# Altium project MASTER.PrjPcb (part 3 of 3)

## Sheet CIV.SchDoc
size C
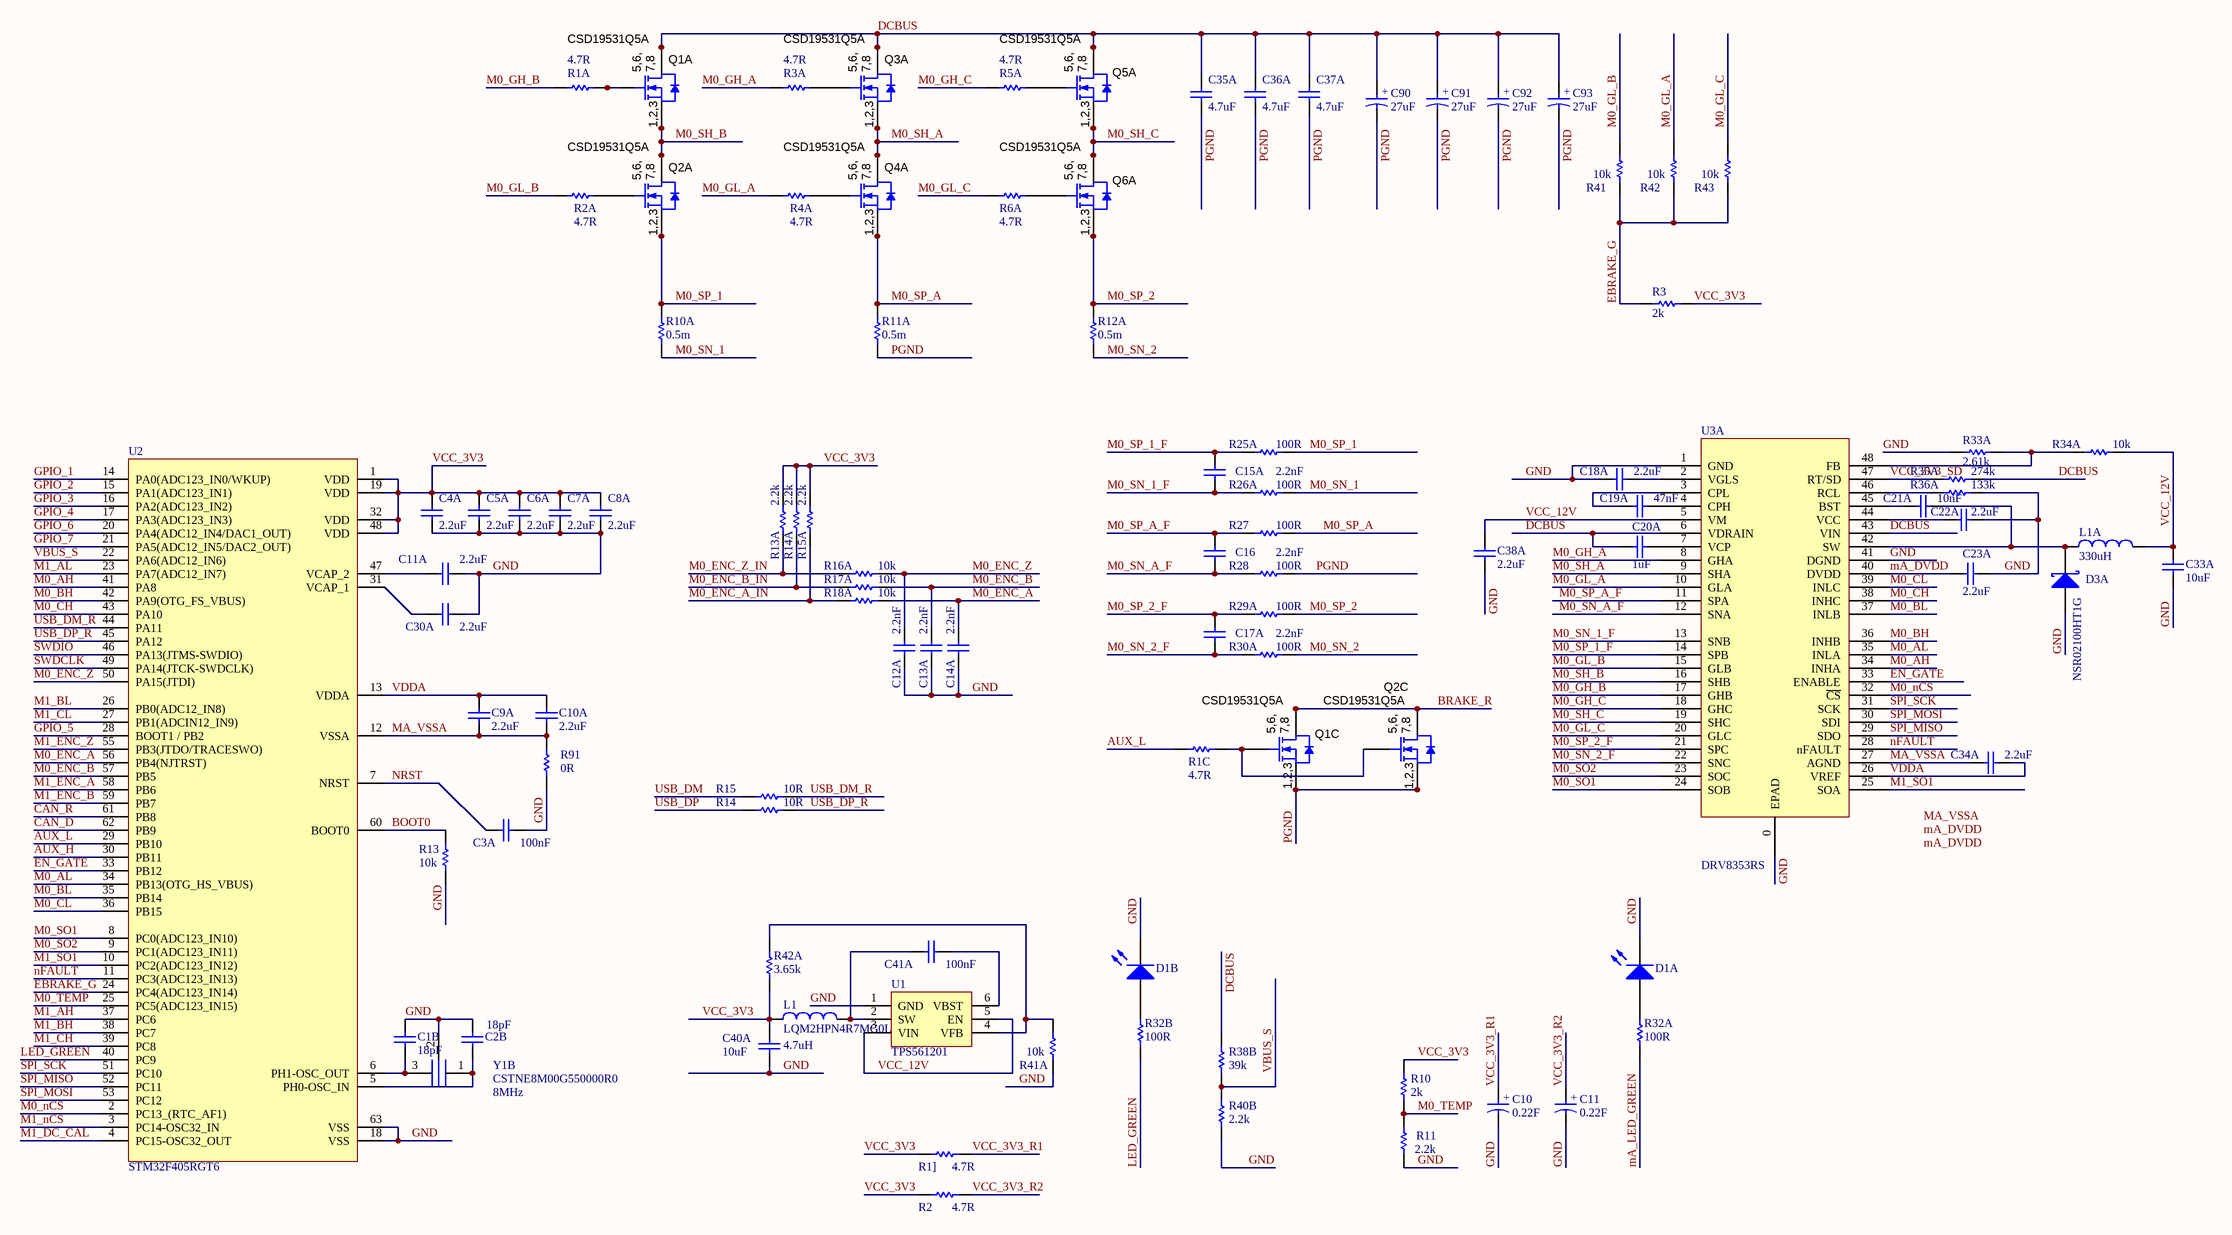
[diagram p6: CIV.SchDoc]

### Parts
(Parts that share a designator on the sheet are numbered #1, #2 ... from top to bottom, then left to right.)
C1B#4  value 18pF  [CAP 0402]  (hidden comment: GCM1555C1H180JA16D)
C2B#4  value 18pF  [CAP 0402]  (hidden comment: GCM1555C1H180JA16D)
C3A#4  value 100nF  [CAP 0402]  (hidden comment: C0402C104K3RACTU)
C4A#4  value 2.2uF  [CAP 0402]  (hidden comment: GRM155C81C225ME15D)
C5A#4  value 2.2uF  [CAP 0402]  (hidden comment: GRM155C81C225ME15D)
C6A#4  value 2.2uF  [CAP 0402]  (hidden comment: GRM155C81C225ME15D)
C7A#4  value 2.2uF  [CAP 0402]  (hidden comment: GRM155C81C225ME15D)
C8A#4  value 2.2uF  [CAP 0402]  (hidden comment: GRM155C81C225ME15D)
C9A#4  value 2.2uF  [CAP 0402]  (hidden comment: GRM155C81C225ME15D)
C10#2  value 0.22F  [DSK-621]  (hidden comment: DSK-3R3H224U-HL)
C10A#4  value 2.2uF  [CAP 0402]  (hidden comment: GRM155C81C225ME15D)
C11#2  value 0.22F  [DSK-621]  (hidden comment: DSK-3R3H224U-HL)
C11A#4  value 2.2uF  [CAP 0402]  (hidden comment: GRM155C81C225ME15D)
C12A#4  value 2.2nF  [CAP 0402]  (hidden comment: GCM155R72A222KA37D)
C13A#4  value 2.2nF  [CAP 0402]  (hidden comment: GCM155R72A222KA37D)
C14A#4  value 2.2nF  [CAP 0402]  (hidden comment: GCM155R72A222KA37D)
C15A#4  value 2.2nF  [CAP 0402]  (hidden comment: GCM155R72A222KA37D)
C16  value 2.2nF  [CAP 0402]  (hidden comment: GCM155R72A222KA37D)
C17A#4  value 2.2nF  [CAP 0402]  (hidden comment: GCM155R72A222KA37D)
C18A#3  value 2.2uF  [CAP 0402]  (hidden comment: GRM155C81C225ME15D)
C19A#3  value 47nF  [CAP 0603]  (hidden comment: C0603C473K1RECAUTO)
C20A#4  value 1uF  [CAP 0402]  (hidden comment: C0402C105K4PACTU)
C21A#3  value 10nF  [CAP 0402]  (hidden comment: GCM155R71E103JA37D)
C22A#3  value 2.2uF  [CAP 0402]  (hidden comment: GRM155C81C225ME15D)
C23A#3  value 2.2uF  [CAP 0402]  (hidden comment: GRM155C81C225ME15D)
C30A#4  value 2.2uF  [CAP 0402]  (hidden comment: GRM155C81C225ME15D)
C33A#4  value 10uF  [CAP 1206]  (hidden comment: TMK316AB7106KL-T)
C34A#5  value 2.2uF  [CAP 0402]  (hidden comment: GRM155C81C225ME15D)
C35A#4  value 4.7uF  [CAP 1210]  (hidden comment: CGA6M3X7S2A475M200AB)
C36A#4  value 4.7uF  [CAP 1210]  (hidden comment: CGA6M3X7S2A475M200AB)
C37A#4  value 4.7uF  [CAP 1210]  (hidden comment: CGA6M3X7S2A475M200AB)
C38A#3  value 2.2uF  [CAP 0402]  (hidden comment: GRM155C81C225ME15D)
C40A#3  value 10uF  [CAP 1206]  (hidden comment: TMK316AB7106KL-T)
C41A#3  value 100nF  [CAP 0402]  (hidden comment: C0402C104K3RACTU)
C90  value 27uF  [Panasonic F]  (hidden comment: 100SXV15M)
C91  value 27uF  [Panasonic F]  (hidden comment: 100SXV15M)
C92  value 27uF  [Panasonic F]  (hidden comment: 100SXV15M)
C93  value 27uF  [Panasonic F]  (hidden comment: 100SXV15M)
D1A#4  LTST-C190KRKT  [LED 0603]  (value not drawn)
D1B#4  LTST-C190KRKT  [LED 0603]  (value not drawn)
D3A#4  NSR02100HT1G  [SOD-323/SC76]
L1#3  LQM2HPN4R7MG0L  value 4.7uH  [IND 1008]
L1A#3  value 330uH  [SDE0805A]  (hidden comment: SDE0805A-331K)
Q1A#4  CSD19531Q5A  [VSONP-8]
Q1C#2  CSD19531Q5A  [VSONP-8]
Q2A#4  CSD19531Q5A  [VSONP-8]
Q2C#2  CSD19531Q5A  [VSONP-8]
Q3A#4  CSD19531Q5A  [VSONP-8]
Q4A#4  CSD19531Q5A  [VSONP-8]
Q5A#4  CSD19531Q5A  [VSONP-8]
Q6A#4  CSD19531Q5A  [VSONP-8]
R1]  value 4.7R  [RES 0402]  (hidden comment: ERJ-PA3J4R7V)
R1A#4  value 4.7R  [RES 0402]  (hidden comment: ERJ-PA3J4R7V)
R1C#2  value 4.7R  [RES 0402]  (hidden comment: ERJ-PA3J4R7V)
R2#2  value 4.7R  [RES 0402]  (hidden comment: ERJ-PA3J4R7V)
R2A#4  value 4.7R  [RES 0402]  (hidden comment: ERJ-PA3J4R7V)
R3#2  value 2k  [RES 0402]  (hidden comment: ERT-J0EG202GM)
R3A#4  value 4.7R  [RES 0402]  (hidden comment: ERJ-PA3J4R7V)
R4A#4  value 4.7R  [RES 0402]  (hidden comment: ERJ-PA3J4R7V)
R5A#4  value 4.7R  [RES 0402]  (hidden comment: ERJ-PA3J4R7V)
R6A#4  value 4.7R  [RES 0402]  (hidden comment: ERJ-PA3J4R7V)
R10#4  value 2k  [RES 0402]  (hidden comment: ERT-J0EG202GM)
R10A#4  0.5m  [RES 2512]
R11#4  value 2.2k  [RES 0402]  (hidden comment: ERJ-2RKF2201X)
R11A#2  0.5m  [RES 2512]
R12A#4  0.5m  [RES 2512]
R13#4  value 10k  [RES 0402]  (hidden comment: ERJ-2RKF1002X)
R13A#5  value 2.2k  [RES 0402]  (hidden comment: ERJ-2RKF2201X)
R14  value 10R  [RES 0402]  (hidden comment: ERJ-2RKF10R0X)
R14A#5  value 2.2k  [RES 0402]  (hidden comment: ERJ-2RKF2201X)
R15  value 10R  [RES 0402]  (hidden comment: ERJ-2RKF10R0X)
R15A#4  value 2.2k  [RES 0402]  (hidden comment: ERJ-2RKF2201X)
R16A#4  value 10k  [RES 0402]  (hidden comment: ERJ-2RKF1002X)
R17A#4  value 10k  [RES 0402]  (hidden comment: ERJ-2RKF1002X)
R18A#4  value 10k  [RES 0402]  (hidden comment: ERJ-2RKF1002X)
R25A#4  value 100R  [RES 0402]  (hidden comment: ERJ-2RKF1000X)
R26A#4  value 100R  [RES 0402]  (hidden comment: ERJ-2RKF1000X)
R27  value 100R  [RES 0402]  (hidden comment: ERJ-2RKF1000X)
R28  value 100R  [RES 0402]  (hidden comment: ERJ-2RKF1000X)
R29A#4  value 100R  [RES 0402]  (hidden comment: ERJ-2RKF1000X)
R30A#4  value 100R  [RES 0402]  (hidden comment: ERJ-2RKF1000X)
R32A#4  value 100R  [RES 0402]  (hidden comment: ERJ-2RKF1000X)
R32B#4  value 100R  [RES 0402]  (hidden comment: ERJ-2RKF1000X)
R33A#3  value 2.61k  [RES 0402]  (hidden comment: ERJ-2RKF2611X)
R34A#4  value 10k  [RES 0402]  (hidden comment: ERJ-2RKF1002X)
R35A#3  value 274k  [RES 0402]  (hidden comment: ERJ-2RKF2743X)
R36A#3  value 133k  [RES 0402]  (hidden comment: ERJ-2RKF1333X)
R38B#4  value 39k  [RES 0402]  (hidden comment: ERJ-2RKF3902X)
R40B#4  value 2.2k  [RES 0402]  (hidden comment: ERJ-2RKF2201X)
R41  value 10k  [RES 0402]  (hidden comment: ERJ-2RKF1002X)
R41A#3  value 10k  [RES 0402]  (hidden comment: ERJ-2RKF1002X)
R42  value 10k  [RES 0402]  (hidden comment: ERJ-2RKF1002X)
R42A#3  value 3.65k  [RES 0402]  (hidden comment: ERJ-2RKF3651X)
R43  value 10k  [RES 0402]  (hidden comment: ERJ-2RKF1002X)
R91#3  value 0R  [RES 0402]  (hidden comment: ERJ-2GE0R00X)
U1#3  TPS561201  [SOT-23-6]
U2#2  STM32F405RGT6  [QFP-64 - P0.5MM]
U3A#3  DRV8353RS  [QFN-48 - P0.5MM]
Y1B#4  CSTNE8M00G550000R0  value 8MHz  [MuRata CSTN]

### Nets
AUX_H: U2#2.30(PB11)
AUX_L: R1C#2.1 U2#2.29(PB10)
BOOT0: R13#4.2 U2#2.60(BOOT0)
BRAKE_R: Q1C#2.5(D) Q1C#2.6(D) Q1C#2.7(D) Q1C#2.8(D) Q1C#2.9(D) Q2C#2.5(D) Q2C#2.6(D) Q2C#2.7(D) Q2C#2.8(D) Q2C#2.9(D)
CAN_D: U2#2.62(PB9)
CAN_R: U2#2.61(PB8)
DCBUS: C20A#4.1 C35A#4.2 C36A#4.2 C37A#4.2 C90.2 C91.2 C92.2 C93.2 Q1A#4.5(D) Q1A#4.6(D) Q1A#4.7(D) Q1A#4.8(D) Q1A#4.9(D) Q3A#4.5(D) Q3A#4.6(D) Q3A#4.7(D) Q3A#4.8(D) Q3A#4.9(D) Q5A#4.5(D) Q5A#4.6(D) Q5A#4.7(D) Q5A#4.8(D) Q5A#4.9(D) R35A#3.2 R38B#4.2 U3A#3.6(VDRAIN) U3A#3.43(VIN)
EBRAKE_G: R3#2.2 R41.1 R42.1 R43.1 U2#2.24(PC4(ADC123_IN14))
EN_GATE: U2#2.33(PB12) U3A#3.33(ENABLE)
GND: C1B#4.2 C2B#4.2 C3A#4.2 C4A#4.2 C5A#4.2 C6A#4.2 C7A#4.2 C8A#4.2 C10#2.1 C11#2.1 C11A#4.2 C12A#4.1 C13A#4.1 C14A#4.1 C18A#3.2 C22A#3.1 C23A#3.1 C30A#4.2 C33A#4.2 C38A#3.2 C40A#3.2 D1A#4.2(K) D1B#4.2(K) D3A#4.1(A) R11#4.1 R13#4.1 R33A#3.1 R36A#3.2 R40B#4.1 R41A#3.1 R91#3.1 U1#3.1(GND) U2#2.18(VSS) U2#2.63(VSS) U3A#3.0(EPAD) U3A#3.1(GND) U3A#3.41(DGND) Y1B#4.2
GPIO_1: U2#2.14(PA0(ADC123_IN0/WKUP))
GPIO_2: U2#2.15(PA1(ADC123_IN1))
GPIO_3: U2#2.16(PA2(ADC123_IN2))
GPIO_4: U2#2.17(PA3(ADC123_IN3))
GPIO_5: U2#2.28(BOOT1_/_PB2)
GPIO_6: U2#2.20(PA4(ADC12_IN4/DAC1_OUT))
GPIO_7: U2#2.21(PA5(ADC12_IN5/DAC2_OUT))
LED_GREEN: R32B#4.2 U2#2.40(PC9)
M0_AH: U2#2.41(PA8) U3A#3.34(INHA)
M0_AL: U2#2.34(PB13(OTG_HS_VBUS)) U3A#3.35(INLA)
M0_BH: U2#2.42(PA9(OTG_FS_VBUS)) U3A#3.36(INHB)
M0_BL: U2#2.35(PB14) U3A#3.37(INLB)
M0_CH: U2#2.43(PA10) U3A#3.38(INHC)
M0_CL: U2#2.36(PB15) U3A#3.39(INLC)
M0_ENC_A: C14A#4.2 R18A#4.2 U2#2.56(PB4(NJTRST))
M0_ENC_A_IN: R15A#4.1 R18A#4.1
M0_ENC_B: C13A#4.2 R17A#4.2 U2#2.57(PB5)
M0_ENC_B_IN: R14A#5.1 R17A#4.1
M0_ENC_Z: C12A#4.2 R16A#4.2 U2#2.50(PA15(JTDI))
M0_ENC_Z_IN: R13A#5.1 R16A#4.1
M0_GH_A: R3A#4.1 U3A#3.8(GHA)
M0_GH_B: R1A#4.1 U3A#3.17(GHB)
M0_GH_C: R5A#4.1 U3A#3.18(GHC)
M0_GL_A: R4A#4.1 R42.2 U3A#3.10(GLA)
M0_GL_B: R2A#4.1 R41.2 U3A#3.15(GLB)
M0_GL_C: R6A#4.1 R43.2 U3A#3.20(GLC)
M0_nCS: U2#2.2(PC13_(RTC_AF1)) U3A#3.32(~{CS})
M0_SH_A: Q3A#4.1(S) Q3A#4.2(S) Q3A#4.3(S) Q4A#4.5(D) Q4A#4.6(D) Q4A#4.7(D) Q4A#4.8(D) Q4A#4.9(D) U3A#3.9(SHA)
M0_SH_B: Q1A#4.1(S) Q1A#4.2(S) Q1A#4.3(S) Q2A#4.5(D) Q2A#4.6(D) Q2A#4.7(D) Q2A#4.8(D) Q2A#4.9(D) U3A#3.16(SHB)
M0_SH_C: Q5A#4.1(S) Q5A#4.2(S) Q5A#4.3(S) Q6A#4.5(D) Q6A#4.6(D) Q6A#4.7(D) Q6A#4.8(D) Q6A#4.9(D) U3A#3.19(SHC)
M0_SN_1: R10A#4.1 R26A#4.2
M0_SN_1_F: C15A#4.1 R26A#4.1 U3A#3.13(SNB)
M0_SN_2: R12A#4.2 R30A#4.2
M0_SN_2_F: C17A#4.1 R30A#4.1 U3A#3.22(SNC)
M0_SN_A_F: C16.1 R28.1 U3A#3.12(SNA)
M0_SO1: U2#2.8(PC0(ADC123_IN10)) U3A#3.24(SOB)
M0_SO2: U2#2.9(PC1(ADC123_IN11)) U3A#3.23(SOC)
M0_SP_1: Q2A#4.1(S) Q2A#4.2(S) Q2A#4.3(S) R10A#4.2 R25A#4.2
M0_SP_1_F: C15A#4.2 R25A#4.1 U3A#3.14(SPB)
M0_SP_2: Q6A#4.1(S) Q6A#4.2(S) Q6A#4.3(S) R12A#4.1 R29A#4.2
M0_SP_2_F: C17A#4.2 R29A#4.1 U3A#3.21(SPC)
M0_SP_A: Q4A#4.1(S) Q4A#4.2(S) Q4A#4.3(S) R11A#2.2 R27.2
M0_SP_A_F: C16.2 R27.1 U3A#3.11(SPA)
M0_TEMP: R10#4.1 R11#4.2 U2#2.25(PC5(ADC123_IN15))
M1_AH: U2#2.37(PC6)
M1_AL: U2#2.23(PA7(ADC12_IN7))
M1_BH: U2#2.38(PC7)
M1_BL: U2#2.26(PB0(ADC12_IN8))
M1_CH: U2#2.39(PC8)
M1_CL: U2#2.27(PB1(ADCIN12_IN9))
M1_DC_CAL: U2#2.4(PC15-OSC32_OUT)
M1_ENC_A: U2#2.58(PB6)
M1_ENC_B: U2#2.59(PB7)
M1_ENC_Z: U2#2.55(PB3(JTDO/TRACESWO))
M1_nCS: U2#2.3(PC14-OSC32_IN)
M1_SO1: U2#2.10(PC2(ADC123_IN12)) U3A#3.25(SOA)
mA_DVDD: C23A#3.2 U3A#3.40(DVDD)
mA_LED_GREEN: R32A#4.2
MA_VSSA: C9A#4.2 C10A#4.2 C34A#5.2 R91#3.2 U2#2.12(VSSA) U3A#3.27(AGND)
nFAULT: U2#2.11(PC3(ADC123_IN13)) U3A#3.28(nFAULT)
NRST: C3A#4.1 U2#2.7(NRST)
PGND: C35A#4.1 C36A#4.1 C37A#4.1 C90.1 C91.1 C92.1 C93.1 Q1C#2.1(S) Q1C#2.2(S) Q1C#2.3(S) Q2C#2.1(S) Q2C#2.2(S) Q2C#2.3(S) R11A#2.1 R28.2  [project net mA_PA_SOURCE]
SPI_MISO: U2#2.52(PC11) U3A#3.29(SDO)
SPI_MOSI: U2#2.53(PC12) U3A#3.30(SDI)
SPI_SCK: U2#2.51(PC10) U3A#3.31(SCK)
SWDCLK: U2#2.49(PA14(JTCK-SWDCLK))
SWDIO: U2#2.46(PA13(JTMS-SWDIO))
USB_DM: R15.1
USB_DM_R: R15.2 U2#2.44(PA11)
USB_DP: R14.1
USB_DP_R: R14.2 U2#2.45(PA12)
VBUS_S: R38B#4.1 R40B#4.2 U2#2.22(PA6(ADC12_IN6))
VCC_3V3: C4A#4.1 C5A#4.1 C6A#4.1 C7A#4.1 C8A#4.1 C40A#3.1 L1#3.1 R1].1 R2#2.1 R3#2.1 R10#4.2 R13A#5.2 R14A#5.2 R15A#4.2 R42A#3.1 U2#2.1(VDD) U2#2.19(VDD) U2#2.32(VDD) U2#2.48(VDD)
VCC_3V3_R1: C10#2.2 R1].2
VCC_3V3_R2: C11#2.2 R2#2.2
VCC_3V3_SD: R35A#3.1 U3A#3.47(RT/SD)
VCC_12V: C33A#4.1 C38A#3.1 L1A#3.2 R34A#4.2 U1#3.3(VIN) U1#3.5(EN) U3A#3.5(VM)
VDDA: C9A#4.1 C10A#4.1 C34A#5.1 U2#2.13(VDDA) U3A#3.26(VREF)
NetC1B#4_1: C1B#4.1 U2#2.6(PH1-OSC_OUT) Y1B#4.3
NetC2B#4_1: C2B#4.1 U2#2.5(PH0-OSC_IN) Y1B#4.1
NetC11A#4_1: C11A#4.1 U2#2.47(VCAP_2)
NetC18A#3_1: C18A#3.1 U3A#3.2(VGLS)
NetC19A#3_1: C19A#3.1 U3A#3.3(CPL)
NetC19A#3_2: C19A#3.2 U3A#3.4(CPH)
NetC20A#4_2: C20A#4.2 U3A#3.7(VCP)
NetC21A#3_1: C21A#3.1 U3A#3.45(BST)
NetC21A#3_2: C21A#3.2 D3A#4.2(K) L1A#3.1 U3A#3.42(SW)
NetC22A#3_2: C22A#3.2 U3A#3.44(VCC)
NetC30A#4_1: C30A#4.1 U2#2.31(VCAP_1)
NetC41A#3_1: C41A#3.1 L1#3.2 U1#3.2(SW)
NetC41A#3_2: C41A#3.2 U1#3.6(VBST)
NetD1A#4_1: D1A#4.1(A) R32A#4.1
NetD1B#4_1: D1B#4.1(A) R32B#4.1
NetQ1A#4_4: Q1A#4.4(G) R1A#4.2
NetQ1C#2_4: Q1C#2.4(G) Q2C#2.4(G) R1C#2.2
NetQ2A#4_4: Q2A#4.4(G) R2A#4.2
NetQ3A#4_4: Q3A#4.4(G) R3A#4.2
NetQ4A#4_4: Q4A#4.4(G) R4A#4.2
NetQ5A#4_4: Q5A#4.4(G) R5A#4.2
NetQ6A#4_4: Q6A#4.4(G) R6A#4.2
NetR33A#3_2: R33A#3.2 R34A#4.1 U3A#3.48(FB)
NetR36A#3_1: R36A#3.1 U3A#3.46(RCL)
NetR41A#3_2: R41A#3.2 R42A#3.2 U1#3.4(VFB)

### Notes on the sheet
- Labels drawn without touching a wire or pin: mA_DVDD, MA_VSSA
- (in symbol 100SXV15M) +
- (in symbol CSD19531Q5A) 5,6,; 7,8; 1,2,3
- (in symbol DSK-3R3H224U-HL) +

### Library data of the parts
C1B#4 C2B#4 = GCM1555C1H180JA16D: CAP 0402 18pF 50V (NP0 Dielectric); WVDC: 50
C3A#4 C41A#3 = C0402C104K3RACTU: CAP 0402 100nF 10V; WVDC: 25
C4A#4 C5A#4 C6A#4 C7A#4 C8A#4 C9A#4 C10A#4 C11A#4 C18A#3 C22A#3 C23A#3 C30A#4 C34A#5 C38A#3 = GRM155C81C225ME15D: CAP 0402 2.2uF 16V; WVDC: 16
C10#2 C11#2 = DSK-3R3H224U-HL: Supercapacitors / Ultracapacitors 3.3V .22F 6.8x2.1; WVDC: 3.3
C12A#4 C13A#4 C14A#4 C15A#4 C16 C17A#4 = GCM155R72A222KA37D: CAP 0402 2.2nF 100V (X7R DIELECTRIC); WVDC: 100
C19A#3 = C0603C473K1RECAUTO: CAP 0603 47nF 100V (X7R DIELECTRIC); WVDC: 100
C20A#4 = C0402C105K4PACTU: CAP 0402 1uF 16V; WVDC: 16
C21A#3 = GCM155R71E103JA37D: CAP 0402 10nF 25V; WVDC: 25
C33A#4 C40A#3 = TMK316AB7106KL-T: CAP 1206 10uF 25V; WVDC: 25
C35A#4 C36A#4 C37A#4 = CGA6M3X7S2A475M200AB: CAP 1206 4.7uF 100V; WVDC: 100
C90-C93 = 100SXV15M: Aluminum Organic Polymer Capacitors 100volt 15uF 40mOhm 8x12mm OS-CON; WVDC: 100
D1A#4 D1B#4 = LTST-C190KRKT: RED LED
D3A#4 = NSR02100HT1G: Schottky Diodes & Rectifiers 100V; Vrrm: 100; If: 200mA
L1#3 = LQM2HPN4R7MG0L: Fixed Inductors 1008 4.7uH 20% 1.1A
L1A#3 = SDE0805A-331K: Fixed Inductors 330uH 10% SMD 0805 AEC-Q200; Isat: 400mA
Q1A#4 Q1C#2 Q2A#4 Q2C#2 Q3A#4 Q4A#4 Q5A#4 Q6A#4 = CSD19531Q5A: 100V 100A VSONP-8 5.3mOhm Pwr MOSFET; Manufacturer: Texas Instruments; Value2: 48 nC; QgTyp_nC: 48; SizeAreaWB_mm2: 56; SizeArea_mm2: 30; SizeX_mm: 6; SizeY_mm: 5; SizeZ_mm: 1; PartNumber: CSD19531Q5A; Value: 100V; VdsMax_V: 100V; Vgs_V: 100V; IdsMax_A: 100A; RoHS: Y; ComponentLink1Description: Datasheet link
R1] R1A#4 R1C#2 R2#2 R2A#4 R3A#4 R4A#4 R5A#4 R6A#4 = ERJ-PA3J4R7V: RES 0402 4.7R 5%
R3#2 R10#4 = ERT-J0EG202GM: NTC THERMISTOR 0402 2k 2%
R10A#4 R11A#2 R12A#4 = CSR2512C0R0005F: RES SMD 0.0005 OHM 1% 3W 2512; Manufacturer: Riedon; Temperature Coefficient: ±100ppm/°C; Supplier 1: Digi-Key; Supplier Part Number 1: 696-1183-2-ND; RoHS: RoHS Compliant; Category: Resistors; Stock: 2000; Pricing 1: 2000=0.19817, 6000=0.1937, 10000=0.187, 50000=0.18148 (USD); Packaging: Tape & Reel (TR); Part Status: Active; Tolerance: ±1%; Power (Watts): 3W; Composition: Metal Element; Features: Current Sense; Operating Temperature: -55°C ~ 170°C; Package / Case: 2512 (6432 Metric); Supplier Device Package: 2512; Size / Dimension: 0.250" L x 0.118" W (6.35mm x 3.00mm); Height - Seated (Max): 0.057" (1.45mm); Failure Rate: -; ComponentLink1URL: http://riedon.com/media/pdf/CSR.pdf; ComponentLink1Description: http://riedon.com/media/pdf/CSR.pdf; Supplier 2: Digi-Key; Supplier Part Number 2: 696-1183-1-ND; Pricing 2: 1=0.69, 10=0.574, 25=0.4916, 50=0.4426, 100=0.3852, 250=0.3442, 500=0.27864, 1000=0.22536 (USD); Manufacturer Part Number: CSR2512C0R0005F
R11#4 R13A#5 R14A#5 R15A#4 R40B#4 = ERJ-2RKF2201X: RES 0402 2.2k 1%
R13#4 R16A#4 R17A#4 R18A#4 R34A#4 R41 R41A#3 R42 R43 = ERJ-2RKF1002X: RES 0402 10k 1%
R14 R15 = ERJ-2RKF10R0X: RES 0402 10R 1%
R25A#4 R26A#4 R27 R28 R29A#4 R30A#4 R32A#4 R32B#4 = ERJ-2RKF1000X: RES 0402 100R 1%
R33A#3 = ERJ-2RKF2611X: RES 0402 2.61k 1%
R35A#3 = ERJ-2RKF2743X: RES 0402 274k 1%
R36A#3 = ERJ-2RKF1333X: RES 0402 133k 1%
R38B#4 = ERJ-2RKF3902X: RES 0402 39k 1%
R42A#3 = ERJ-2RKF3651X: RES 0402 3.65k 1%
R91#3 = ERJ-2GE0R00X: RES 0402 0R
U1#3 = TPS561201: 4.5V to 17V Input, 1A Synchronous Step-Down Voltage Regulator in 6-pin SOT-23
U2#2 = STM32F405RGT6(V2): Cortex M4 MCU
U3A#3 = DRV8353RS: 100V Three Phase Gate Driver With 3 Current Shunt Amplifiers and Buck Regulator (SPI)
Y1B#4 = CSTNE8M00G550000R0: Ceramic Resonator 8.0000MHz 33pf 0.5%

## Nets that join several sheets
AUX_H: OverDrive (U2#1.70), CIV (U2#2.30)
AUX_L: OverDrive (R1C#1.1 U2#1.69), CIV (R1C#2.1 U2#2.29)
BOOT0: Vesc (J10#1.2 R13#1.2 U1A#1.60 U1B#1.60), TestPanel (J10#2.2), Vesc_Simple_2 (J10#3.2 R13#2.2 U1A#2.60 U1B#2.60), OverDrive (R13#3.2), CIV (R13#4.2 U2#2.60)
CAN_D: OverDrive (U2#1.140), CIV (U2#2.62)
CAN_R: OverDrive (U2#1.139), CIV (U2#2.61)
DCBUS: OverDrive (44 pins), CIV (27 pins)
DISABLE_GATES: Vesc (J10#1.12 Q7A.1 Q7B.1 R12.2), TestPanel (J10#2.11), Vesc_Simple_2 (J10#3.11)
EN_GATE: OverDrive (U2#1.73 U3A#2.33 U3B#2.33), CIV (U2#2.33 U3A#3.33)
GND: Vesc (99 pins), TestPanel (12 pins), Vesc_Simple_2 (62 pins), OverDrive (58 pins), CIV (38 pins)
GPIO_1: OverDrive (U2#1.34), CIV (U2#2.14)
GPIO_2: OverDrive (U2#1.35), CIV (U2#2.15)
GPIO_3: OverDrive (U2#1.36), CIV (U2#2.16)
GPIO_4: OverDrive (U2#1.37), CIV (U2#2.17)
GPIO_5: OverDrive (U2#1.48), CIV (U2#2.28)
M0_AH: OverDrive (U2#1.100 U3A#2.34), CIV (U2#2.41 U3A#3.34)
M0_AL: OverDrive (U2#1.74 U3A#2.35), CIV (U2#2.34 U3A#3.35)
M0_BH: OverDrive (U2#1.101 U3A#2.36), CIV (U2#2.42 U3A#3.36)
M0_BL: OverDrive (U2#1.75 U3A#2.37), CIV (U2#2.35 U3A#3.37)
M0_CH: OverDrive (U2#1.102 U3A#2.38), CIV (U2#2.43 U3A#3.38)
M0_CL: OverDrive (U2#1.76 U3A#2.39), CIV (U2#2.36 U3A#3.39)
M0_ENC_A: OverDrive (C14A#3.2 R18A#3.2 U2#1.134), CIV (C14A#4.2 R18A#4.2 U2#2.56)
M0_ENC_A_IN: OverDrive (JHA#3.4 R15A#3.1 R18A#3.1), CIV (R15A#4.1 R18A#4.1)
M0_ENC_B: OverDrive (C13A#3.2 R17A#3.2 U2#1.135), CIV (C13A#4.2 R17A#4.2 U2#2.57)
M0_ENC_B_IN: OverDrive (JHA#3.3 R14A#4.1 R17A#3.1), CIV (R14A#5.1 R17A#4.1)
M0_ENC_Z: OverDrive (C12A#3.2 R16A#3.2 U2#1.110), CIV (C12A#4.2 R16A#4.2 U2#2.50)
M0_ENC_Z_IN: OverDrive (JHA#3.2 R13A#4.1 R16A#3.1), CIV (R13A#5.1 R16A#4.1)
M0_GH_A: OverDrive (R3A#3.1 U3A#2.8), CIV (R3A#4.1 U3A#3.8)
M0_GH_B: OverDrive (R1A#3.1 U3A#2.17), CIV (R1A#4.1 U3A#3.17)
M0_GH_C: OverDrive (R5A#3.1 U3A#2.18), CIV (R5A#4.1 U3A#3.18)
M0_GL_A: OverDrive (R4A#3.1 U3A#2.10), CIV (R4A#4.1 R42.2 U3A#3.10)
M0_GL_B: OverDrive (R2A#3.1 U3A#2.15), CIV (R2A#4.1 R41.2 U3A#3.15)
M0_GL_C: OverDrive (R6A#3.1 U3A#2.20), CIV (R6A#4.1 R43.2 U3A#3.20)
M0_nCS: OverDrive (U2#1.7 U3A#2.32), CIV (U2#2.2 U3A#3.32)
M0_SH_A: OverDrive (9 pins), CIV (9 pins)
M0_SH_B: OverDrive (9 pins), CIV (9 pins)
M0_SH_C: OverDrive (9 pins), CIV (9 pins)
M0_SN_1: OverDrive (R10A#3.1 R26A#3.2), CIV (R10A#4.1 R26A#4.2)
M0_SN_1_F: OverDrive (C15A#3.1 R26A#3.1 U3A#2.13), CIV (C15A#4.1 R26A#4.1 U3A#3.13)
M0_SN_2: OverDrive (R12A#3.2 R30A#3.2), CIV (R12A#4.2 R30A#4.2)
M0_SN_2_F: OverDrive (C17A#3.1 R30A#3.1 U3A#2.22), CIV (C17A#4.1 R30A#4.1 U3A#3.22)
M0_SO1: OverDrive (U2#1.26 U3A#2.24), CIV (U2#2.8 U3A#3.24)
M0_SO2: OverDrive (U2#1.27 U3A#2.23), CIV (U2#2.9 U3A#3.23)
M0_SP_1: OverDrive (5 pins), CIV (5 pins)
M0_SP_1_F: OverDrive (C15A#3.2 R25A#3.1 U3A#2.14), CIV (C15A#4.2 R25A#4.1 U3A#3.14)
M0_SP_2: OverDrive (5 pins), CIV (5 pins)
M0_SP_2_F: OverDrive (C17A#3.2 R29A#3.1 U3A#2.21), CIV (C17A#4.2 R29A#4.1 U3A#3.21)
M0_TEMP: OverDrive (R10#3.1 R11#3.2), CIV (R10#4.1 R11#4.2 U2#2.25)
M1_AH: OverDrive (U2#1.96 U3B#2.34), CIV (U2#2.37)
M1_AL: OverDrive (U2#1.43 U3B#2.35), CIV (U2#2.23)
M1_BH: OverDrive (U2#1.97 U3B#2.36), CIV (U2#2.38)
M1_BL: OverDrive (U2#1.46 U3B#2.37), CIV (U2#2.26)
M1_CH: OverDrive (U2#1.98 U3B#2.38), CIV (U2#2.39)
M1_CL: OverDrive (U2#1.47 U3B#2.39), CIV (U2#2.27)
M1_DC_CAL: OverDrive (U2#1.9), CIV (U2#2.4)
M1_ENC_A: OverDrive (C14B#3.2 R18B#3.2 U2#1.136), CIV (U2#2.58)
M1_ENC_B: OverDrive (C13B#3.2 R17B#3.2 U2#1.137), CIV (U2#2.59)
M1_ENC_Z: OverDrive (C12B#3.2 R16B#3.2 U2#1.133), CIV (U2#2.55)
M1_nCS: OverDrive (U2#1.8 U3B#2.32), CIV (U2#2.3)
M1_SO1: OverDrive (U2#1.28 U3B#2.24), CIV (U2#2.10 U3A#3.25)
mA_AGND: Vesc_Simple_2 (C34A#2.2), OverDrive (C34A#4.2)
mA_AN_IN: Vesc (R38A#1.1 R40A#1.2 U1A#1.11), Vesc_Simple_2 (R38A#2.1 R40A#2.2 U1A#2.10), OverDrive (R38A#3.1 R40A#3.2)
mA_CURRENT_A: Vesc (U1A#1.8 U3A#1.25), Vesc_Simple_2 (U1A#2.26 U12.1)
mA_CURRENT_C: Vesc (U1A#1.10 U3A#1.23), Vesc_Simple_2 (U1A#2.27 U11.1)
mA_DVDD: Vesc (5 pins), OverDrive (C23A#2.2 U3A#2.40), CIV (C23A#3.2 U3A#3.40)
mA_EN_GATE: Vesc (R39A.2 U1A#1.57), Vesc_Simple_2 (U1A#2.51)
mA_eStop: Vesc (J11#1.13 R7A.1 R8A.1 R9A.1), TestPanel (J12#2.13), Vesc_Simple_2 (J12#3.13)
mA_H1: Vesc (U1A#1.41 U3A#1.34), Vesc_Simple_2 (U1A#2.41 U22.6)
mA_H2: Vesc (U1A#1.42 U3A#1.36), Vesc_Simple_2 (U1A#2.42 U23.6)
mA_H3: Vesc (U1A#1.43 U3A#1.38), Vesc_Simple_2 (U1A#2.43 U24.6)
mA_HALL1_IN: Vesc (JHA#1.2 R15A#1.1 R18A#1.1), Vesc_Simple_2 (JHA#2.2 R15A#2.1 R18A#2.1)
mA_HALL2_IN: Vesc (JHA#1.3 R14A#1.1 R17A#1.1), Vesc_Simple_2 (JHA#2.3 R14A#3.1 R17A#2.1)
mA_HALL3_IN: Vesc (JHA#1.4 R13A#1.1 R16A#1.1), Vesc_Simple_2 (JHA#2.4 R13A#3.1 R16A#2.1)
mA_HALL_1: Vesc (C14A#1.2 R18A#1.2 U1A#1.37), Vesc_Simple_2 (C14A#2.2 R18A#2.2 U1A#2.58)
mA_HALL_2: Vesc (C13A#1.2 R17A#1.2 U1A#1.38), Vesc_Simple_2 (C13A#2.2 R17A#2.2 U1A#2.59)
mA_HALL_3: Vesc (C12A#1.2 R16A#1.2 U1A#1.39), Vesc_Simple_2 (C12A#2.2 R16A#2.2 U1A#2.52)
mA_L1: Vesc (U1A#1.34 U3A#1.35), Vesc_Simple_2 (U1A#2.34 U22.7)
mA_L2: Vesc (U1A#1.35 U3A#1.37), Vesc_Simple_2 (U1A#2.35 U23.7)
mA_L3: Vesc (U1A#1.36 U3A#1.39), Vesc_Simple_2 (U1A#2.36 U24.7)
mA_LED_GREEN: Vesc (R32A#1.2 U1A#1.26), Vesc_Simple_2 (R32A#2.2 U1A#2.17), OverDrive (R32A#3.2), CIV (R32A#4.2)
mA_MISO_ADC_EXT2: Vesc (J11#1.10 U1A#1.22), TestPanel (J11#2.5 JA.7), Vesc_Simple_2 (J11#3.5 U1A#2.22)
mA_nFAULT: Vesc (U1A#1.53 U3A#1.28), Vesc_Simple_2 (U1A#2.53)
mA_PA_AGND: Vesc (C35A#1.1 R10A#1.1 R26A#1.2), Vesc_Simple_2 (R10A#2.1 R26A#2.2)
mA_PA_AGND_F: Vesc (C15A#1.1 R26A#1.1 U3A#1.12), Vesc_Simple_2 (C15A#2.1 R26A#2.1 U12.3)
mA_PA_HI: Vesc (R1A#1.1 U3A#1.8), Vesc_Simple_2 (R1A#2.1 U22.4)
mA_PA_LO: Vesc (R2A#1.1 U3A#1.10), Vesc_Simple_2 (R2A#2.1 U22.9)
mA_PA_SOURCE: Vesc (10 pins), Vesc_Simple_2 (28 pins), OverDrive (20 pins), CIV (15 pins)
mA_PA_SOURCE_F: Vesc (C15A#1.2 R25A#1.1 U3A#1.11), Vesc_Simple_2 (C15A#2.2 R25A#2.1 U12.4)
mA_PB_HI: Vesc (R3A#1.1 U3A#1.17), Vesc_Simple_2 (R3A#2.1 U23.4)
mA_PB_LO: Vesc (R4A#1.1 U3A#1.15), Vesc_Simple_2 (R4A#2.1 U23.9)
mA_PC4: TestPanel (J11#2.12), Vesc_Simple_2 (J11#3.12 U1A#2.24)
mA_PC5: TestPanel (J11#2.13), Vesc_Simple_2 (J11#3.13 U1A#2.25)
mA_PC_AGND: Vesc (C37A#1.1 R12A#1.1 R30A#1.2), Vesc_Simple_2 (R12A#2.2 R30A#2.2)
mA_PC_AGND_F: Vesc (C17A#1.1 R30A#1.1 U3A#1.22), Vesc_Simple_2 (C17A#2.1 R30A#2.1 U11.3)
mA_PC_HI: Vesc (R5A#1.1 U3A#1.18), Vesc_Simple_2 (R5A#2.1 U24.4)
mA_PC_LO: Vesc (R6A#1.1 U3A#1.20), Vesc_Simple_2 (R6A#2.1 U24.9)
mA_PC_SOURCE: Vesc (5 pins), Vesc_Simple_2 (8 pins)
mA_PC_SOURCE_F: Vesc (C17A#1.2 R29A#1.1 U3A#1.21), Vesc_Simple_2 (C17A#2.2 R29A#2.1 U11.4)
mA_PHASE_A: Vesc (11 pins), Vesc_Simple_2 (12 pins)
mA_PHASE_B: Vesc (11 pins), Vesc_Simple_2 (12 pins)
mA_PHASE_C: Vesc (11 pins), Vesc_Simple_2 (12 pins)
mA_RX: Vesc (J11#1.8 U1A#1.30), TestPanel (J11#2.10 JA.6), Vesc_Simple_2 (J11#3.10 U1A#2.30)
mA_SCK_ADC_EXT: Vesc (J11#1.9 U1A#1.21), TestPanel (J11#2.4 JA.4), Vesc_Simple_2 (J11#3.4 U1A#2.21)
mA_SCL: TestPanel (J11#2.6), Vesc_Simple_2 (J11#3.6 U1A#2.23)
mA_SDA: TestPanel (J11#2.3), Vesc_Simple_2 (J11#3.3 U1A#2.20)
mA_SWDCLK: Vesc (J11#1.4 U1A#1.49), TestPanel (J11#2.2), Vesc_Simple_2 (J11#3.2 U1A#2.49)
mA_SWDIO: Vesc (J11#1.3 U1A#1.46), TestPanel (J11#2.1), Vesc_Simple_2 (J11#3.1 U1A#2.46)
mA_TX: Vesc (J11#1.7 U1A#1.29), TestPanel (J11#2.9 JA.5), Vesc_Simple_2 (J11#3.9 U1A#2.29)
mA_USB_DM: Vesc (J11#1.6 U1A#1.44), TestPanel (J11#2.8 R13A#2.1), Vesc_Simple_2 (J11#3.8 U1A#2.44)
mA_USB_DP: Vesc (J11#1.5 U1A#1.45), TestPanel (J11#2.7 R14A#2.1), Vesc_Simple_2 (J11#3.7 U1A#2.45)
mA_VOLTAGE_A: Vesc (R23A#1.1 R24A#1.2 U1A#1.14), Vesc_Simple_2 (R19A#2.1 R20A#2.2 U1A#2.16)
mA_VOLTAGE_B: Vesc (R21A#1.1 R22A#1.2 U1A#1.15), Vesc_Simple_2 (R21A#2.1 R22A#2.2 U1A#2.15)
mA_VOLTAGE_C: Vesc (R19A#1.1 R20A#1.2 U1A#1.16), Vesc_Simple_2 (R23A#2.1 R24A#2.2 U1A#2.14)
MA_VSSA: Vesc_Simple_2 (10 pins), OverDrive (C9A#3.2 R91#2.2), CIV (6 pins)
mB_AN_IN: Vesc (R38B#1.1 R40B#1.2 U1B#1.11), Vesc_Simple_2 (R38B#2.1 R40B#2.2 U1B#2.10), OverDrive (R38B#3.1 R40B#3.2)
mB_CURRENT_A: Vesc (U1B#1.8 U3B#1.25), Vesc_Simple_2 (U1B#2.26)
mB_CURRENT_C: Vesc (U1B#1.10 U3B#1.23), Vesc_Simple_2 (U1B#2.27)
mB_DVDD: Vesc (5 pins), OverDrive (C23B#3.2 U3B#2.40)
mB_EN_GATE: Vesc (R39B.2 U1B#1.57), Vesc_Simple_2 (U1B#2.51)
mB_eStop: Vesc (J11#1.12 R7B#1.1 R8B#1.1 R9B#1.1), TestPanel (J12#2.14), Vesc_Simple_2 (J12#3.14 R7B#2.1 R8B#2.1 R9B#2.1), OverDrive (R7B#3.1 R8B#3.1 R9B#3.1)
mB_H1: Vesc (U1B#1.41 U3B#1.34), Vesc_Simple_2 (U1B#2.41)
mB_H2: Vesc (U1B#1.42 U3B#1.36), Vesc_Simple_2 (U1B#2.42)
mB_H3: Vesc (U1B#1.43 U3B#1.38), Vesc_Simple_2 (U1B#2.43)
mB_HALL1_IN: Vesc (JHB#1.2 R15B#1.1 R18B#1.1), Vesc_Simple_2 (JHB#2.2 R15B#2.1 R18B#2.1)
mB_HALL2_IN: Vesc (JHB#1.3 R14B#1.1 R17B#1.1), Vesc_Simple_2 (JHB#2.3 R14B#3.1 R17B#2.1)
mB_HALL3_IN: Vesc (JHB#1.4 R13B#1.1 R16B#1.1), Vesc_Simple_2 (JHB#2.4 R13B#3.1 R16B#2.1)
mB_HALL_1: Vesc (C14B#1.2 R18B#1.2 U1B#1.37), Vesc_Simple_2 (C14B#2.2 R18B#2.2 U1B#2.37)
mB_HALL_2: Vesc (C13B#1.2 R17B#1.2 U1B#1.38), Vesc_Simple_2 (C13B#2.2 R17B#2.2 U1B#2.38)
mB_HALL_3: Vesc (C12B#1.2 R16B#1.2 U1B#1.39), Vesc_Simple_2 (C12B#2.2 R16B#2.2 U1B#2.39)
mB_L1: Vesc (U1B#1.34 U3B#1.35), Vesc_Simple_2 (U1B#2.34)
mB_L2: Vesc (U1B#1.35 U3B#1.37), Vesc_Simple_2 (U1B#2.35)
mB_L3: Vesc (U1B#1.36 U3B#1.39), Vesc_Simple_2 (U1B#2.36)
mB_LED_GREEN: Vesc (R32B#1.2 U1B#1.26), Vesc_Simple_2 (R32B#2.2 U1B#2.17), OverDrive (R32B#3.2)
mB_MISO_ADC_EXT2: Vesc (J10#1.6 U1B#1.22), TestPanel (J10#2.5 JB#2.7), Vesc_Simple_2 (J10#3.5 U1B#2.22)
mB_nFAULT: Vesc (U1B#1.53 U3B#1.28), Vesc_Simple_2 (U1B#2.53)
mB_PA_AGND: Vesc (C35B.1 R10B#1.1 R26B#1.2), Vesc_Simple_2 (R10B#2.1 R26B#2.2)
mB_PA_AGND_F: Vesc (C15B#1.1 R26B#1.1 U3B#1.12), Vesc_Simple_2 (C15B#2.1 R26B#2.1)
mB_PA_HI: Vesc (R1B#1.1 U3B#1.8), Vesc_Simple_2 (R1B#2.1)
mB_PA_LO: Vesc (R2B#1.1 U3B#1.10), Vesc_Simple_2 (R2B#2.1)
mB_PA_SOURCE_F: Vesc (C15B#1.2 R25B#1.1 U3B#1.11), Vesc_Simple_2 (C15B#2.2 R25B#2.1)
mB_PB_AGND: Vesc (8 pins), Vesc_Simple_2 (Q4B#2.1 Q4B#2.2 Q4B#2.3)
mB_PB_HI: Vesc (R3B#1.1 U3B#1.17), Vesc_Simple_2 (R3B#2.1)
mB_PB_LO: Vesc (R4B#1.1 U3B#1.15), Vesc_Simple_2 (R4B#2.1)
mB_PC_AGND: Vesc (C37B.1 R12B#1.1 R30B#1.2), Vesc_Simple_2 (R12B#2.2 R30B#2.2)
mB_PC_AGND_F: Vesc (C17B#1.1 R30B#1.1 U3B#1.22), Vesc_Simple_2 (C17B#2.1 R30B#2.1)
mB_PC_HI: Vesc (R5B#1.1 U3B#1.18), Vesc_Simple_2 (R5B#2.1)
mB_PC_LO: Vesc (R6B#1.1 U3B#1.20), Vesc_Simple_2 (R6B#2.1)
mB_PC_SOURCE: Vesc (5 pins), Vesc_Simple_2 (5 pins)
mB_PC_SOURCE_F: Vesc (C17B#1.2 R29B#1.1 U3B#1.21), Vesc_Simple_2 (C17B#2.2 R29B#2.1)
mB_PHASE_A: Vesc (11 pins), Vesc_Simple_2 (10 pins)
mB_PHASE_B: Vesc (11 pins), Vesc_Simple_2 (10 pins)
mB_PHASE_C: Vesc (11 pins), Vesc_Simple_2 (10 pins)
mB_RX: Vesc (J10#1.9 U1B#1.30), TestPanel (J10#2.7 JB#2.6), Vesc_Simple_2 (J10#3.7 U1B#2.30)
mB_SCK_ADC_EXT: Vesc (J10#1.5 U1B#1.21), TestPanel (J10#2.4 JB#2.4), Vesc_Simple_2 (J10#3.4 U1B#2.21)
mB_SWDCLK: Vesc (J11#1.2 U1B#1.49), TestPanel (J10#2.14), Vesc_Simple_2 (J10#3.14 U1B#2.49)
mB_SWDIO: Vesc (J11#1.1 U1B#1.46), TestPanel (J10#2.13), Vesc_Simple_2 (J10#3.13 U1B#2.46)
mB_TX: Vesc (J10#1.7 U1B#1.29), TestPanel (J10#2.6 JB#2.5), Vesc_Simple_2 (J10#3.6 U1B#2.29)
mB_USB_DM: Vesc (J10#1.11 U1B#1.44), TestPanel (J10#2.9 R13B#2.1), Vesc_Simple_2 (J10#3.9 U1B#2.44)
mB_USB_DP: Vesc (J10#1.10 U1B#1.45), TestPanel (J10#2.8 R14B#2.1), Vesc_Simple_2 (J10#3.8 U1B#2.45)
mB_VOLTAGE_A: Vesc (R23B#1.1 R24B#1.2 U1B#1.14), Vesc_Simple_2 (R23B#2.1 R24B#2.2 U1B#2.14)
mB_VOLTAGE_B: Vesc (R21B#1.1 R22B#1.2 U1B#1.15), Vesc_Simple_2 (R21B#2.1 R22B#2.2 U1B#2.15)
mB_VOLTAGE_C: Vesc (R19B#1.1 R20B#1.2 U1B#1.16), Vesc_Simple_2 (R19B#2.1 R20B#2.2 U1B#2.16)
nFAULT: OverDrive (U2#1.81 U3A#2.28 U3B#2.28), CIV (U2#2.11 U3A#3.28)
NRST: Vesc (5 pins), TestPanel (J10#2.3), Vesc_Simple_2 (5 pins), OverDrive (C3A#3.1 C3B#3.1), CIV (C3A#4.1 U2#2.7)
NTC_M: Vesc (J12#1.2 R10#1.1 R11#1.2), Vesc_Simple_2 (R10#2.1 R11#2.2 U1A#2.11)
SPI_MISO: OverDrive (U2#1.112 U3A#2.29 U3B#2.29), CIV (U2#2.52 U3A#3.29)
SPI_MOSI: OverDrive (U2#1.113 U3A#2.30 U3B#2.30), CIV (U2#2.53 U3A#3.30)
SPI_SCK: OverDrive (U2#1.111 U3A#2.31 U3B#2.31), CIV (U2#2.51 U3A#3.31)
SWDCLK: OverDrive (U2#1.109), CIV (U2#2.49)
SWDIO: OverDrive (U2#1.105), CIV (U2#2.46)
USB_DM: OverDrive (U2#1.103), CIV (R15.1)
USB_DP: OverDrive (U2#1.104), CIV (R14.1)
V_CHG: TestPanel (J12#2.5 J12#2.6 J12#2.7 J12#2.8), Vesc_Simple_2 (15 pins), OverDrive (R5#2.2)
V_CHG_SNS: Vesc_Simple_2 (R5#1.1 R6#1.2 U1A#2.9), OverDrive (R5#2.1 R6#2.2)
V_SUPPLY: Vesc (54 pins), Vesc_Simple_2 (38 pins)
VBUS_S: OverDrive (U2#1.42), CIV (R38B#4.1 R40B#4.2 U2#2.22)
VCC_3V3: Vesc (44 pins), TestPanel (J10#2.10 JA.2 JB#2.2), Vesc_Simple_2 (44 pins), OverDrive (26 pins), CIV (19 pins)
VCC_3V3_SD: Vesc (J10#1.14 R35A#1.1 U3A#1.47), OverDrive (R35A#2.1 U3A#2.47), CIV (R35A#3.1 U3A#3.47)
VCC_12V: Vesc (8 pins), TestPanel (J10#2.12), Vesc_Simple_2 (14 pins), OverDrive (9 pins), CIV (7 pins)
VCC_12V_SD: Vesc (J10#1.13 R35B#1.1 U3B#1.47), TestPanel (J11#2.11), Vesc_Simple_2 (J11#3.11), OverDrive (R35B#2.1 U3B#2.47)
VDDA: Vesc_Simple_2 (C9A#2.1 U1A#2.13), OverDrive (C9A#3.1), CIV (5 pins)